# Altium schematic sheet LCD.SchDoc
size A; SheetNumber: 7; SheetTotal: 8
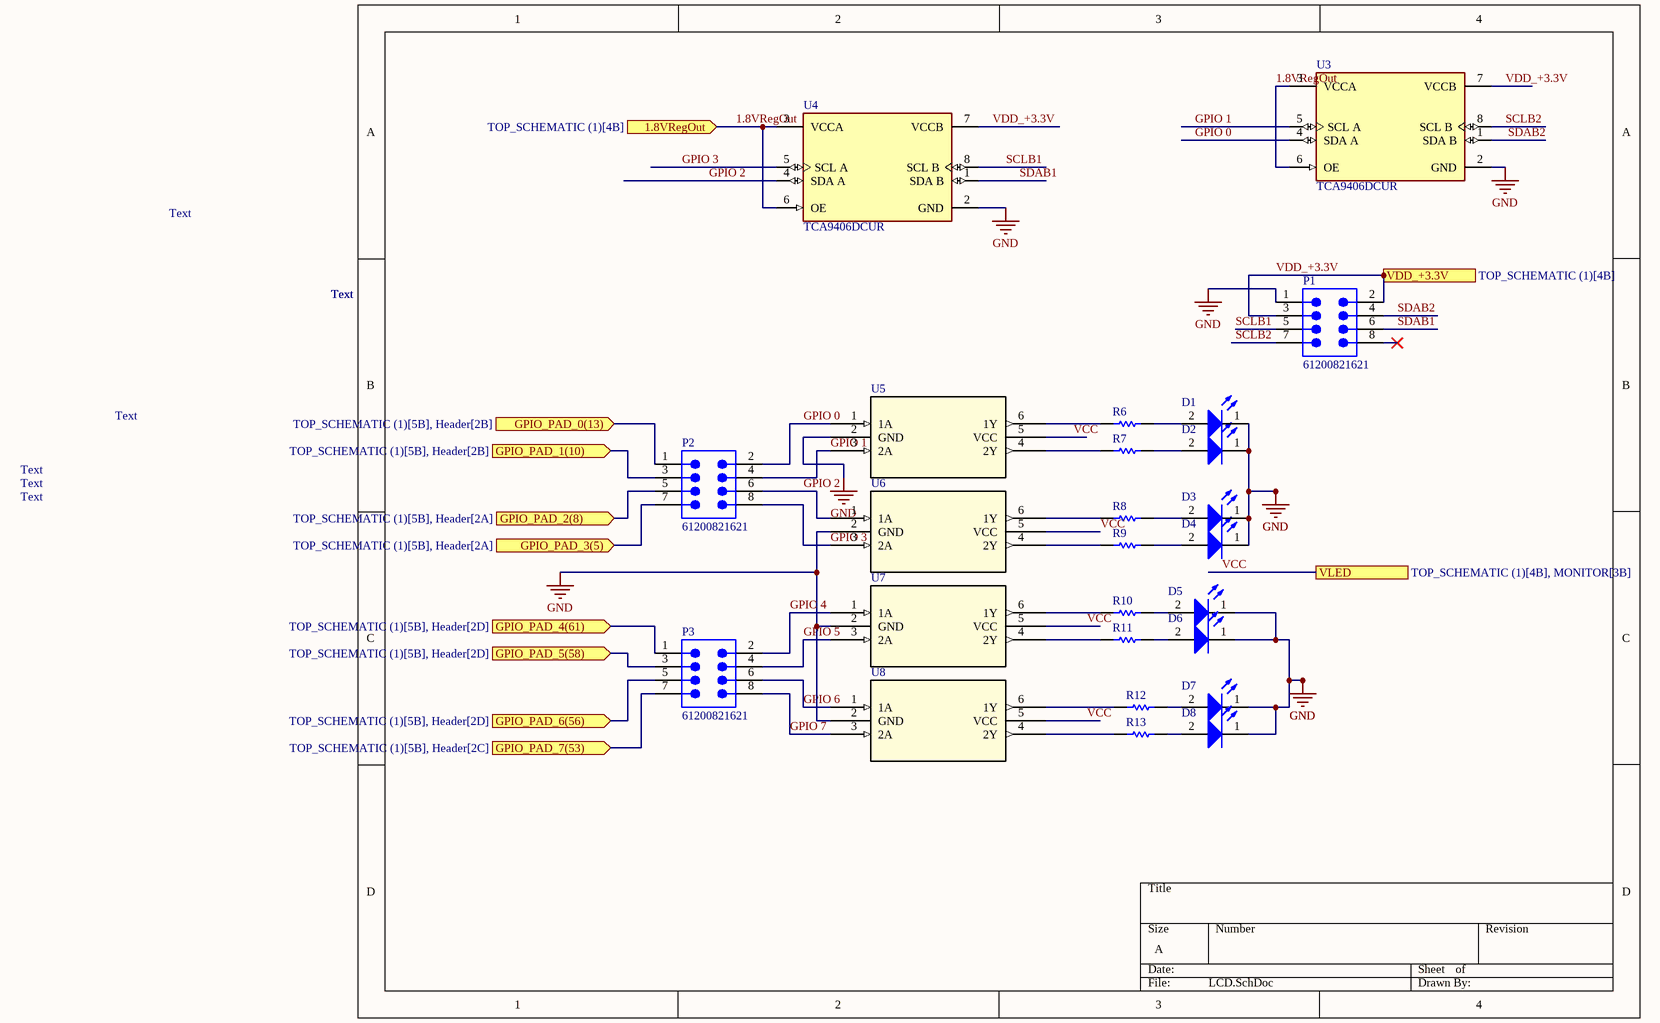
[diagram p0: LCD.SchDoc]

## Parts
D1  150120BS75000  [WL-SMCW_1206_150120xx75000]  (value not drawn)
D2  150120BS75000  [WL-SMCW_1206_150120xx75000]  (value not drawn)
D3  150120BS75000  [WL-SMCW_1206_150120xx75000]  (value not drawn)
D4  150120BS75000  [WL-SMCW_1206_150120xx75000]  (value not drawn)
D5  150120BS75000  [WL-SMCW_1206_150120xx75000]  (value not drawn)
D6  150120BS75000  [WL-SMCW_1206_150120xx75000]  (value not drawn)
D7  150120BS75000  [WL-SMCW_1206_150120xx75000]  (value not drawn)
D8  150120BS75000  [WL-SMCW_1206_150120xx75000]  (value not drawn)
P1  61200821621  [61200821621]
P2  61200821621  [61200821621]
P3  61200821621  [61200821621]
R6  RC1206FR-10750RL  [RESC3116X65X40LL10T20]  (value not drawn)
R7  RC1206FR-10750RL  [RESC3116X65X40LL10T20]  (value not drawn)
R8  RC1206FR-10750RL  [RESC3116X65X40LL10T20]  (value not drawn)
R9  RC1206FR-10750RL  [RESC3116X65X40LL10T20]  (value not drawn)
R10  RC1206FR-10750RL  [RESC3116X65X40LL10T20]  (value not drawn)
R11  RC1206FR-10750RL  [RESC3116X65X40LL10T20]  (value not drawn)
R12  RC1206FR-10750RL  [RESC3116X65X40LL10T20]  (value not drawn)
R13  RC1206FR-10750RL  [RESC3116X65X40LL10T20]  (value not drawn)
U3  TCA9406DCUR  [FP-DCU0008A-IPC_B]
U4  TCA9406DCUR  [FP-DCU0008A-IPC_B]
U5  74LVC2G17GV,125  [SC-74;TSOP6_NEX]  (value not drawn)
U6  74LVC2G17GV,125  [SC-74;TSOP6_NEX]  (value not drawn)
U7  74LVC2G17GV,125  [SC-74;TSOP6_NEX]  (value not drawn)
U8  74LVC2G17GV,125  [SC-74;TSOP6_NEX]  (value not drawn)

## Ports
1.8VRegOut (in, see TOP_SCHEMATIC (1)[4B]), GPIO_PAD_0(13) (in, see TOP_SCHEMATIC (1)[5B], Header[2B]), GPIO_PAD_1(10) (in, see TOP_SCHEMATIC (1)[5B], Header[2B]), GPIO_PAD_2(8) (in, see TOP_SCHEMATIC (1)[5B], Header[2A]), GPIO_PAD_3(5) (in, see TOP_SCHEMATIC (1)[5B], Header[2A]), GPIO_PAD_4(61) (in, see TOP_SCHEMATIC (1)[5B], Header[2D]), GPIO_PAD_5(58) (in, see TOP_SCHEMATIC (1)[5B], Header[2D]), GPIO_PAD_6(56) (in, see TOP_SCHEMATIC (1)[5B], Header[2D]), GPIO_PAD_7(53) (in, see TOP_SCHEMATIC (1)[5B], Header[2C]), VDD_+3.3V (see TOP_SCHEMATIC (1)[4B]), VLED (see TOP_SCHEMATIC (1)[4B], MONITOR[3B])

## Nets
GND: D1.1(K) D2.1(K) D3.1(K) D4.1(K) D5.1(K) D6.1(K) D7.1(K) D8.1(K) P1.1 U3.2(GND) U4.2(GND) U5.2(GND) U6.2(GND) U7.2(GND) U8.2(GND)
1.8VRegOut: U3.3(VCCA) U3.6(OE) U4.3(VCCA) U4.6(OE) ; port 1.8VRegOut
GPIO 0: P2.2 U3.4(SDA_A) U5.1(1A)
GPIO 1: P2.4 U3.5(SCL_A) U5.3(2A)
GPIO 2: P2.6 U4.4(SDA_A) U6.1(1A)
GPIO 3: P2.8 U4.5(SCL_A) U6.3(2A)
GPIO 4: P3.2 U7.1(1A)
GPIO 5: P3.4 U7.3(2A)
GPIO 6: P3.6 U8.1(1A)
GPIO 7: P3.8 U8.3(2A)
GPIO_PAD_0(13): P2.1 ; port GPIO_PAD_0(13)
GPIO_PAD_1(10): P2.3 ; port GPIO_PAD_1(10)
GPIO_PAD_2(8): P2.5 ; port GPIO_PAD_2(8)
GPIO_PAD_3(5): P2.7 ; port GPIO_PAD_3(5)
GPIO_PAD_4(61): P3.1 ; port GPIO_PAD_4(61)
GPIO_PAD_5(58): P3.3 ; port GPIO_PAD_5(58)
GPIO_PAD_6(56): P3.5 ; port GPIO_PAD_6(56)
GPIO_PAD_7(53): P3.7 ; port GPIO_PAD_7(53)
SCLB1: P1.5 U4.8(SCL_B)
SCLB2: P1.7 U3.8(SCL_B)
SDAB1: P1.6 U4.1(SDA_B)
SDAB2: P1.4 U3.1(SDA_B)
VCC: U5.5(VCC) U6.5(VCC) U7.5(VCC) U8.5(VCC) ; port VLED
VDD_+3.3V: P1.2 P1.3 U3.7(VCCB) U4.7(VCCB) ; port VDD_+3.3V
NetD1_2: D1.2(A) R6.2
NetD2_2: D2.2(A) R7.2
NetD3_2: D3.2(A) R8.2
NetD4_2: D4.2(A) R9.2
NetD5_2: D5.2(A) R10.2
NetD6_2: D6.2(A) R11.2
NetD7_2: D7.2(A) R12.2
NetD8_2: D8.2(A) R13.2
NetR6_1: R6.1 U5.6(1Y)
NetR7_1: R7.1 U5.4(2Y)
NetR8_1: R8.1 U6.6(1Y)
NetR9_1: R9.1 U6.4(2Y)
NetR10_1: R10.1 U7.6(1Y)
NetR11_1: R11.1 U7.4(2Y)
NetR12_1: R12.1 U8.6(1Y)
NetR13_1: R13.1 U8.4(2Y)

Not connected (* = marked no-connect by the designer): P1 8*

## Notes on the sheet
- Text

## Library data of the parts
D1-D8 = CMP-1426-00015-4: Wurth Elektronik LED, WL-SMCW, 3216 (1206), 470 nm, 3.2 x 1.6 x 0.68mm; Manufacturer Package Identifier: LED_1206; Manufacturer Lifecycle Status: ACTIVE; Test Current: 20mA; Color: Blue; YEOL: 1 = Estimated lifetime > 10 years; Wavelength: 470nm; Viewing Angle: 140°; Peak Wavelength: 465nm; Forward Voltage: 3.2V; Luminous Intensity: 145mcd; Forward Current: 100mA; Lens Style: Clear, Rectangular; Max Reverse Voltage (DC): 5V; Case/Package: 1206; Case Code (Imperial): 1206; RoHS: Compliant; Case Code (Metric): 3216; Height: 680µm; REACH SVHC: Unknown; Length: 3.2mm; Mount: Surface Mount; Packaging: Tape and Reel; Min Operating Temperature: -40°C; Width: 1.6mm; Lifecycle Status: Production; Max Operating Temperature: 85°C; Dominant Wavelength: 470nm
P1-P3 = CMP-1502-00006-3: Wr-bhd; 2.54MM Pitch 8 Way 2 Row Shrouded Straight Pcb Header, Surface Mount; Number of Contacts: 8; Operating Supply Voltage: 250V; Gender: Male; Current Rating: 3A; Contact Resistance: 20mΩ; Connector Type: Male Pin; Insulation Resistance: 1GΩ; Pitch: 2.54mm; RoHS: Compliant; Row Spacing: 2.54mm; Color: Black; Termination: Solder; Min Operating Temperature: -40°C; Number of Rows: 2; Number of Positions: 8; Contact Material: Copper; Orientation: Vertical; Number of Pins: 8; Contact Plating: Gold; Insulation Material: PBT; Lead Pitch: 2.54mm; Length: 17.82mm; Max Operating Temperature: 105°C; Mount: Through Hole
R6-R13 = CMP-2003-04964-1: Manufacturer: Yageo; Part Number: RC1206FR-10750RL
U3 U4 = CMP-0314-00417-3: IC TRNSLTR BIDIRECTIONAL US8; Propagation Delay: 4.4ns; Min Supply Voltage: 1.65V; Low Level Output Current: 50mA; Logic Function: Translator; Data Rate: 24Mbps; Turn-On Delay Time: 260ns; Max Supply Voltage: 5.5V; Number of Channels: 2; High Level Output Current: -50mA; Output Type: Voltage; Number of Pins: 8; Weight: 0.00067oz; Lead Free: Lead Free; Case/Package: VSSOP; Packaging: Tape and Reel; REACH SVHC: No SVHC; Package Quantity: 1; Length: 2.1mm; Contact Plating: Gold; Width: 2.4mm; Radiation Hardening: No; Number of Bits: 2; Height: 0.8mm; Number of Outputs: 2; Max Operating Temperature: 85°C; Min Operating Temperature: -40°C
U5-U8 = 74LVC2G17GV,125: Description; Manufacturer_Name: Nexperia; Type: Logic; Copyright: Copyright (C) 2026 Ultra Librarian. All rights reserved.; Manufacturer_Part_Number: 74LVC2G17GV,125; RefDes: RefDes